# Altium project handMultilayer.PrjPcb
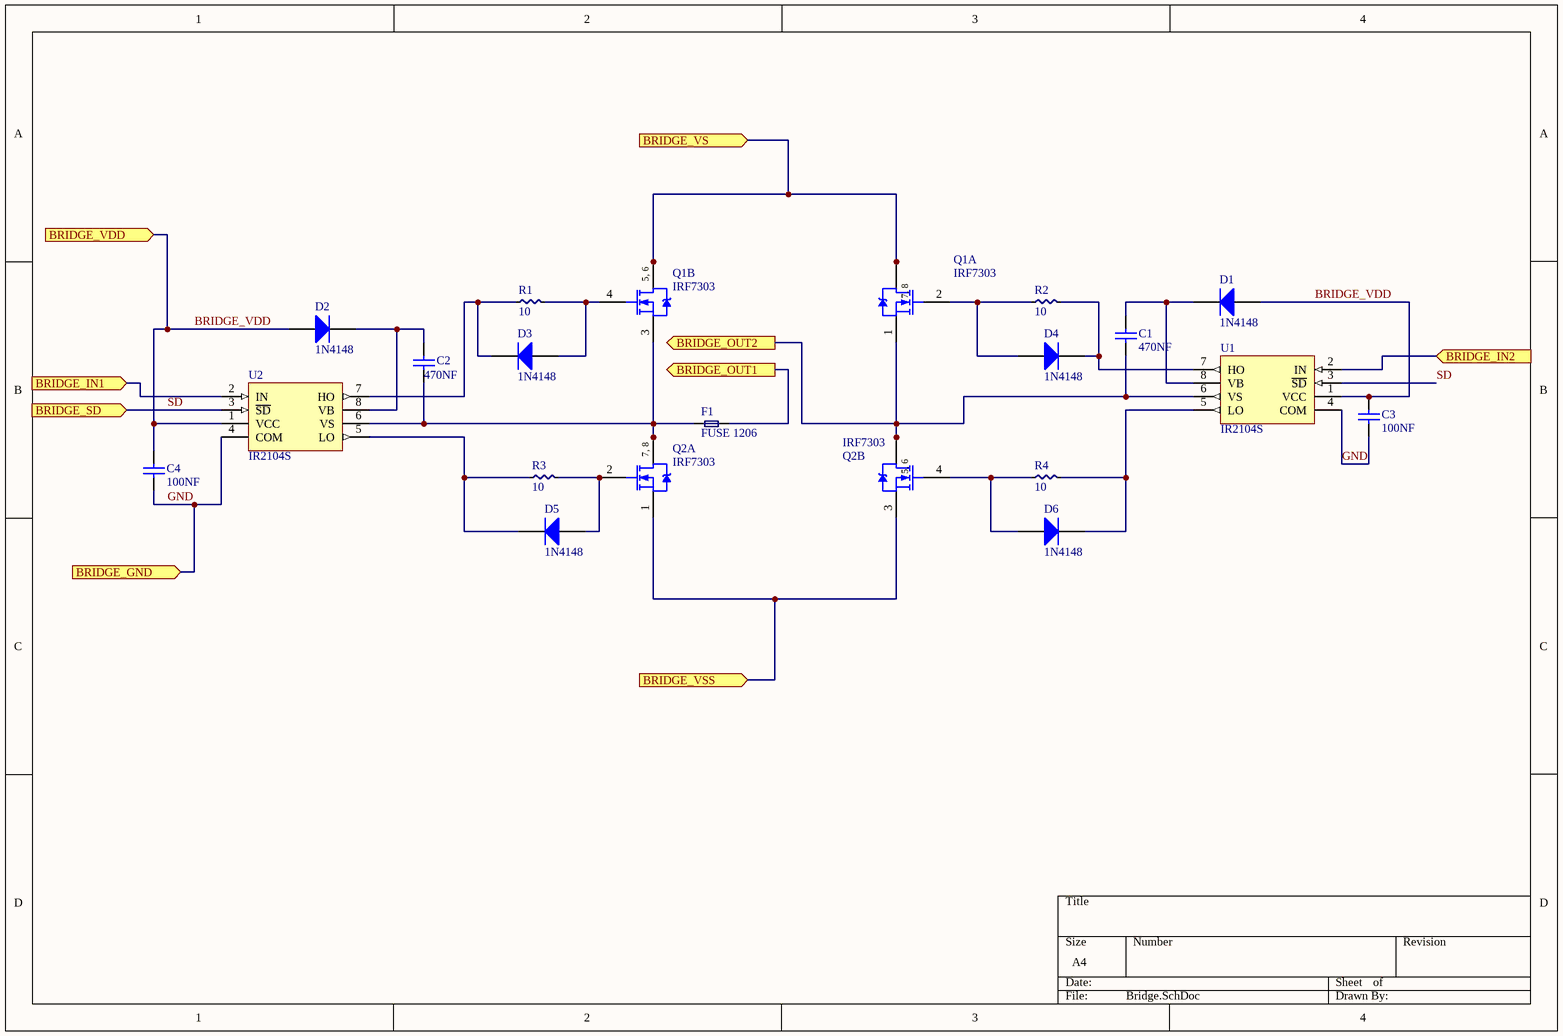
[diagram p0: Bridge.SchDoc]
3 sheets, 69 parts. Net scope: hierarchical (ports join the sheet entries above them; power ports are global).
Board file: HAND_MULTILAYER.PcbDoc
Sheets:
  Bridge.SchDoc
  main.SchDoc
  PULSE_SELECT.SchDoc

## Sheet Bridge.SchDoc
size A4

### Parts
C1  470NF  [MY_CAP_SMD_1206]
C2  470NF  [MY_CAP_SMD_1206]
C3  100NF  [MY_CAP_SMD_0805]
C4  100NF  [MY_CAP_SMD_0805]
D1  1N4148  [MY_DIOD1N5822_SMD]
D2  1N4148  [MY_DIOD1N5822_SMD]
D3  1N4148  [MY_DIOD1N5822_SMD]
D4  1N4148  [MY_DIOD1N5822_SMD]
D5  1N4148  [MY_DIOD1N5822_SMD]
D6  1N4148  [MY_DIOD1N5822_SMD]
F1  FUSE 1206  [FUSE1206]
Q1  IRF7303  [SO-8_N]  (parts A,B of 2)
Q2  IRF7303  [SO-8_N]  (parts A,B of 2)
R1  10  [MY_RES_SMD_0805]
R2  10  [MY_RES_SMD_0805]
R3  10  [MY_RES_SMD_0805]
R4  10  [MY_RES_SMD_0805]
U1  IR2104S  [SO-8_N]
U2  IR2104S  [SO-8_N]

### Ports
BRIDGE_GND (in), BRIDGE_IN1 (in), BRIDGE_IN2 (in), BRIDGE_OUT1 (out), BRIDGE_OUT2 (out), BRIDGE_SD (in), BRIDGE_VDD (in), BRIDGE_VS (in), BRIDGE_VSS (in)

### Nets
BRIDGE_VDD: C3.2 C4.2 D1.A D2.A U1.1(VCC) U2.1(VCC) ; port BRIDGE_VDD
GND: C3.1 C4.1 U1.4(COM) U2.4(COM) ; port BRIDGE_GND
SD: U1.3(~{SD}) U2.3(~{SD}) ; port BRIDGE_SD
NetC1_1: C1.1 Q1.1(S) Q2.5(D) Q2.6(D) U1.6(VS) ; port BRIDGE_OUT2
NetC1_2: C1.2 D1.K U1.8(VB)
NetC2_1: C2.1 F1.2 Q1.3(S) Q2.7(D) Q2.8(D) U2.6(VS)
NetC2_2: C2.2 D2.K U2.8(VB)
NetD3_A: D3.A Q1.4(G) R1.2
NetD3_K: D3.K R1.1 U2.7(HO)
NetD4_A: D4.A Q1.2(G) R2.1
NetD4_K: D4.K R2.2 U1.7(HO)
NetD5_A: D5.A Q2.2(G) R3.2
NetD5_K: D5.K R3.1 U2.5(LO)
NetD6_A: D6.A Q2.4(G) R4.1
NetD6_K: D6.K R4.2 U1.5(LO)
NetF1_1: F1.1 ; port BRIDGE_OUT1
NetQ1_5: Q1.5(D) Q1.6(D) Q1.7(D) Q1.8(D) ; port BRIDGE_VS
NetQ2_1: Q2.1(S) Q2.3(S) ; port BRIDGE_VSS
NetU1_2: U1.2(IN) ; port BRIDGE_IN2
NetU2_2: U2.2(IN) ; port BRIDGE_IN1

### Notes on the sheet
- (in symbol IRF7303, part A) 7, 8
- (in symbol IRF7303, part B) 5, 6

### Library data of the parts
C1 C2 = CAP SMD_1206: 3.2 mm × 1.6 mm
C3 C4 = CAP SMD_0805: 2.0 mm × 1.25 mm
D1-D6 = 1N5822-smd-5*2mm
Q1 Q2 = IRF7303: HEXFET Power MOSFET; Published: 8-Jun-2000; LatestRevisionDate: 13-Apr-2006; LatestRevisionNote: IPC-7351 Footprint Added.; DatasheetVersion: Aug-1997; PackageVersion: Feb-2001; PackageReference: SO-8; Publisher: Altium Limited; PackageDescription: 8-Pin Plastic Small Outline Integrated Circuit 1.27 mm Pitch; Code_JEDEC: MS-012-AA; Code_IPC: SOIC127P600-8; ComponentLink1Description: Manufacturer Link; ComponentLink1URL: http://www.irf.com/; ComponentLink2Description: Datasheet; ComponentLink2URL: http://www.irf.com/product-info/datasheets/data/irf7303.pdf
R1-R4 = RES SMD 0805
U1 U2 = IR2104S: High and Low Side Driver; Published: 8-Jun-2000; LatestRevisionDate: 13-Apr-2006; LatestRevisionNote: IPC-7351 Footprint Added.; DatasheetVersion: PD600461; PackageVersion: Feb-2001; PackageReference: SO-8; Publisher: Altium Limited; PackageDescription: 8-Pin Plastic Small Outline Integrated Circuit 1.27 mm Pitch; Code_JEDEC: MS-012-AA; Code_IPC: SOIC127P600-8; ComponentLink1Description: Manufacturer Link; ComponentLink1URL: http://www.irf.com/; ComponentLink2Description: Datasheet; ComponentLink2URL: http://www.irf.com/product-info/datasheets/data/ir2104.pdf

## Sheet main.SchDoc
size A2
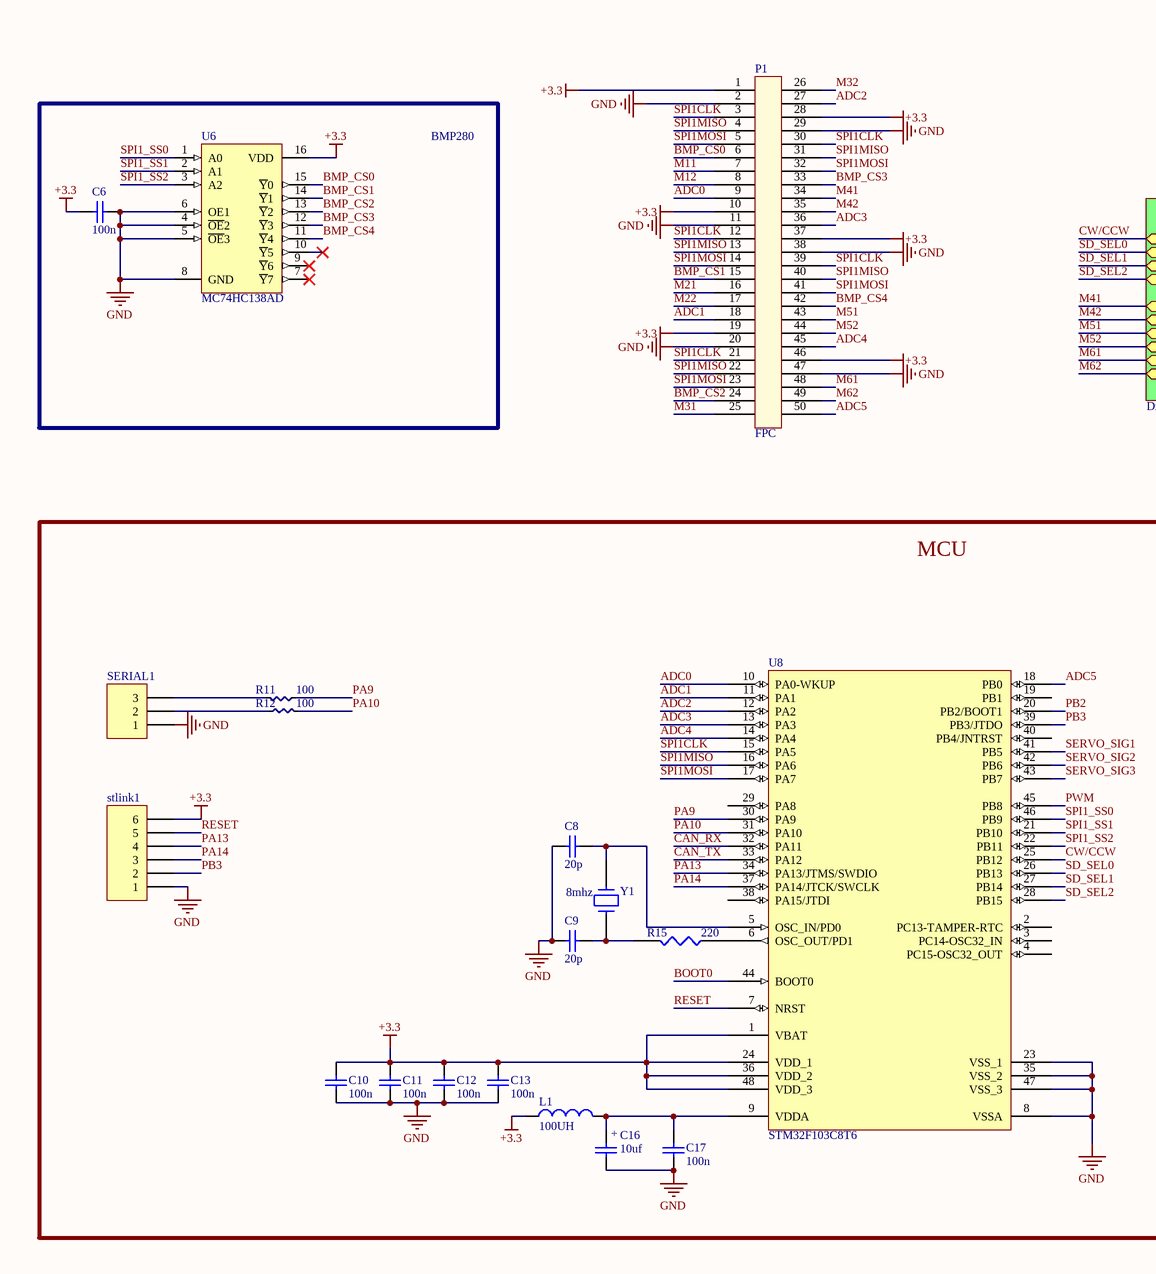
[diagram p1: main.SchDoc, left]
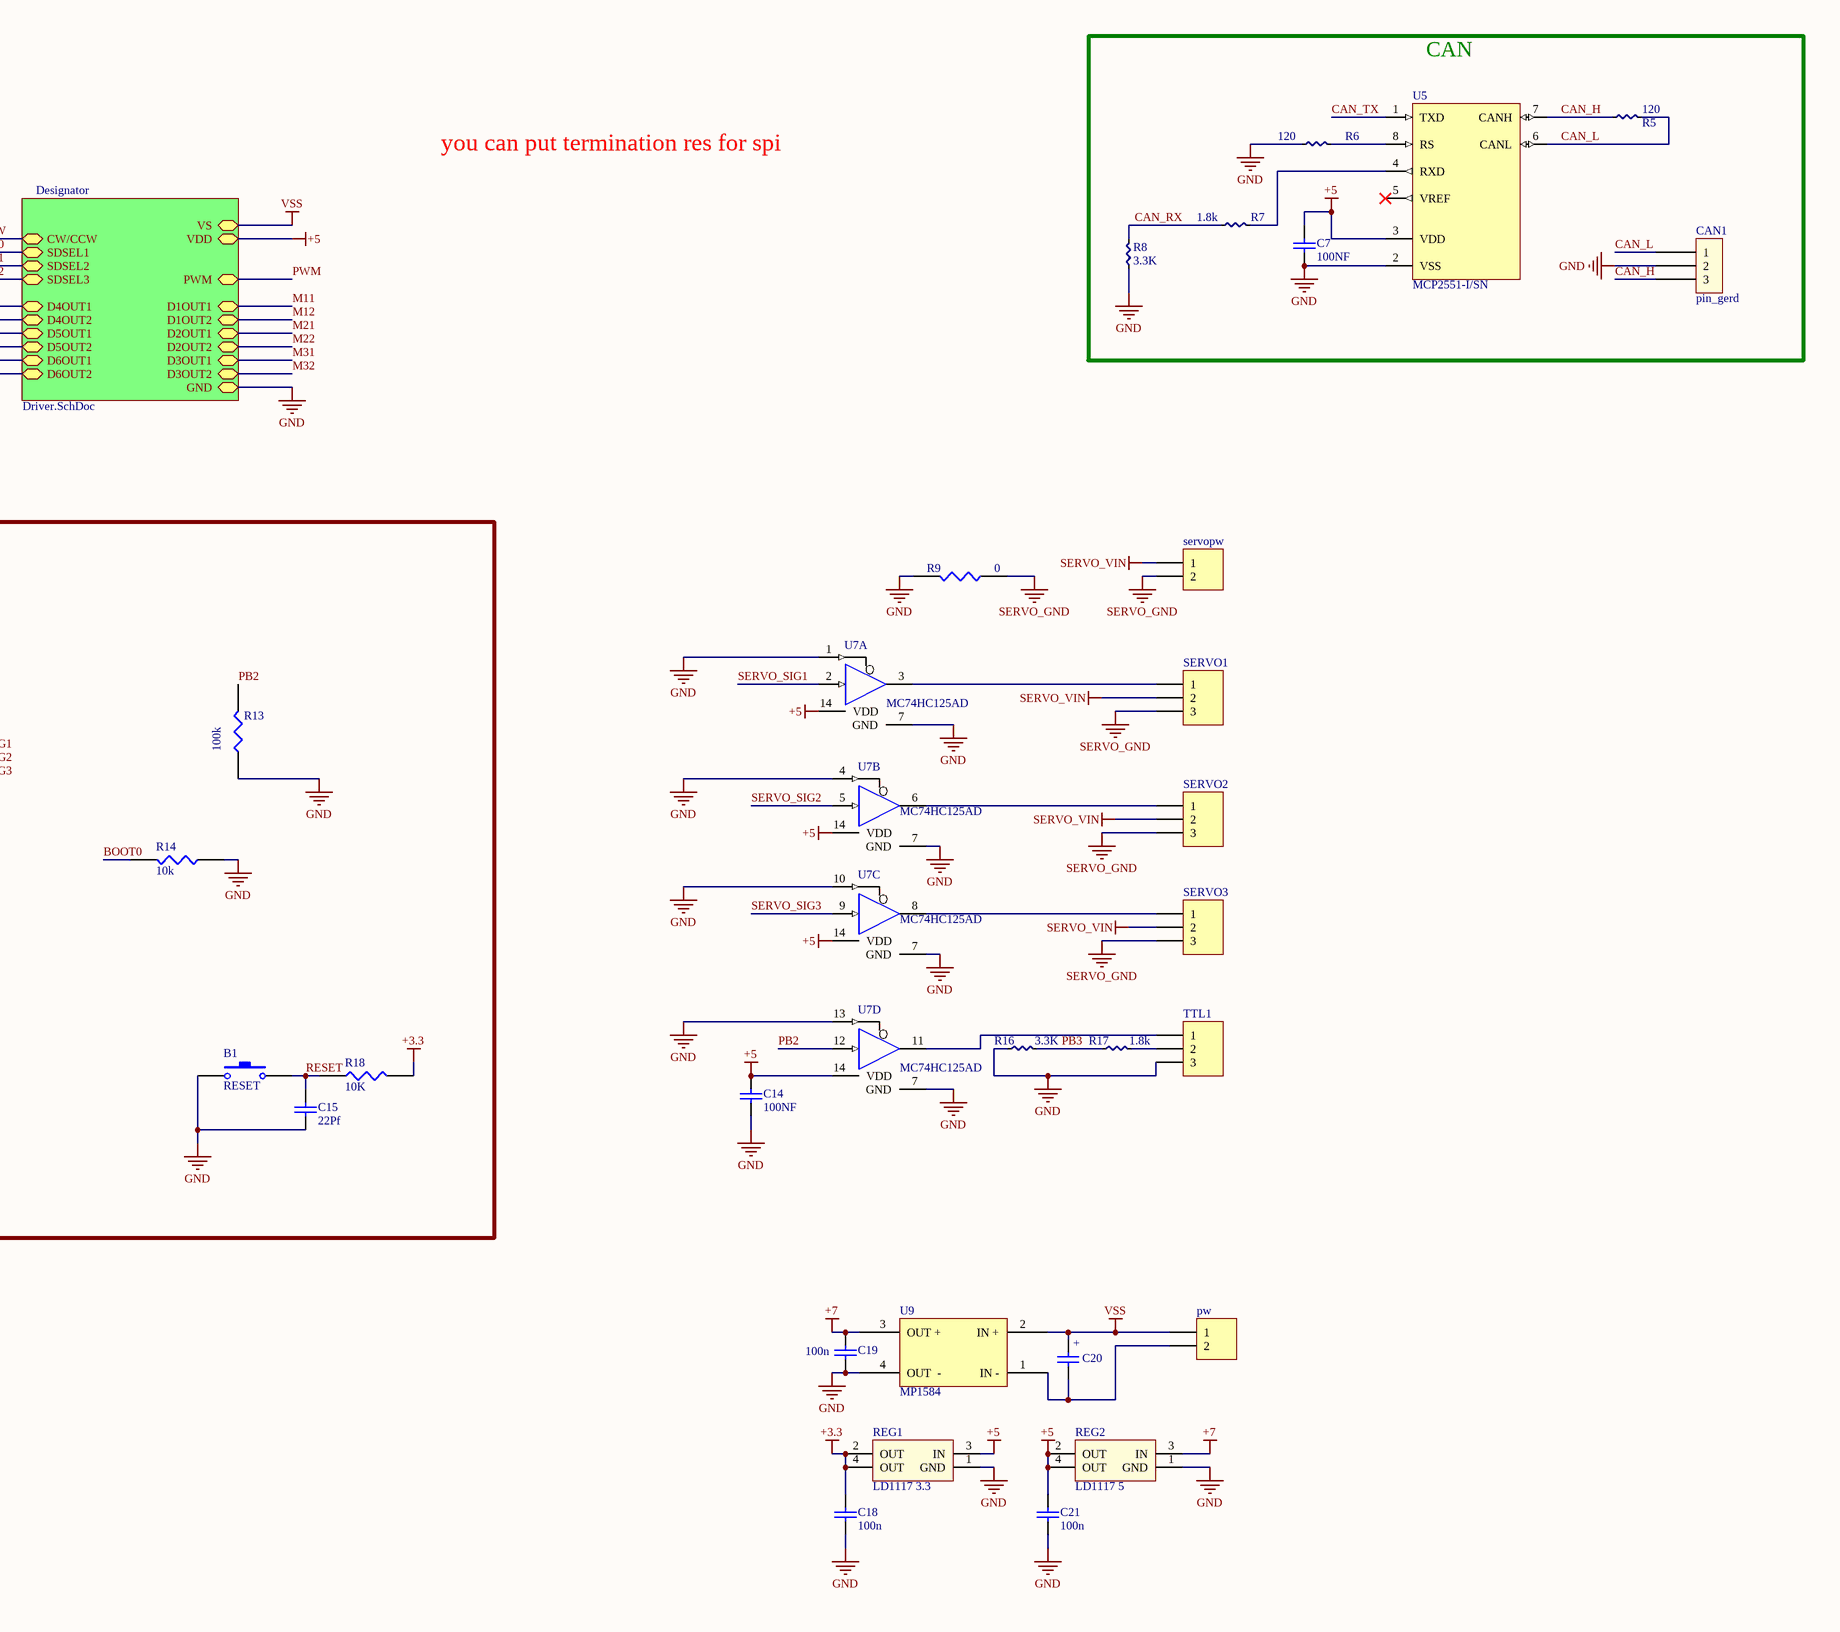
[diagram p2: main.SchDoc, right]

### Parts
B1  RESET  [SMD PUSH BUTTON]
C6  100n  [MY_CAP_SMD_0805]
C7  100NF  [MY_CAP_SMD_0805]
C8  20p  [MY_CAP_SMD_0805]
C9  20p  [MY_CAP_SMD_0805]
C10  100n  [MY_CAP_SMD_0805]
C11  100n  [MY_CAP_SMD_0805]
C12  100n  [MY_CAP_SMD_0805]
C13  100n  [MY_CAP_SMD_0805]
C14  100NF  [MY_CAP_SMD_0805]
C15  22Pf  [MY_CAP_SMD_0805]
C16  10uf  [MY_cap_smd10uf]
C17  100n  [MY_CAP_SMD_0805]
C18  100n  [MY_CAP_SMD_0805]
C19  100n  [MY_CAP_SMD_0805]
C20  Cap  [MY_CAP_SMD-C]  (value not drawn)
C21  100n  [MY_CAP_SMD_0805]
CAN1  pin_gerd  [MY_PINGERD3]
L1  100UH  [MY_SMD_INDUCTOR]
P1  FPC  [FPC-50-POS-0.5-MM]
pw  Header 2  [My_1X02]  (value not drawn)
R5  120  [MY_RES_SMD_0805]
R6  120  [MY_RES_SMD_0805]
R7  1.8k  [MY_RES_SMD_0805]
R8  3.3K  [MY_RES_SMD_0805]
R9  0  [MY_RES_SMD_0805]
R11  100  [MY_RES_SMD_0805]
R12  100  [MY_RES_SMD_0805]
R13  100k  [MY_RES_SMD_0805]
R14  10k  [MY_RES_SMD_0805]
R15  220  [MY_RES_SMD_0805]
R16  3.3K  [MY_RES_SMD_0805]
R17  1.8k  [MY_RES_SMD_0805]
R18  10K  [MY_RES_SMD_0805]
REG1  LD1117 3.3  [MY_LD1117-3.3]
REG2  LD1117 5  [MY_LD1117-3.3]
SERIAL1  Header 3  [My_1X03]  (value not drawn)
SERVO1  Header 3  [My_1X03]  (value not drawn)
SERVO2  Header 3  [My_1X03]  (value not drawn)
SERVO3  Header 3  [My_1X03]  (value not drawn)
servopw  Header 2  [My_1X02]  (value not drawn)
stlink1  Header 6  [My_1X06]  (value not drawn)
TTL1  Header 3  [My_1X03]  (value not drawn)
U5  MCP2551-I/SN  [SOIC-SN8_N]
U6  MC74HC138AD  [751B-03_N]
U7  MC74HC125AD  [751A-02_N]  (parts A,B,C,D of 4)
U8  STM32F103C8T6  [LQFP48_N]
U9  MP1584  [mp1584]
Y1  8mhz  [My_Crystal - SMD]

### Blocks framed on the sheet
CAN: C7 CAN1 R5-R8 U5
BMP280: C6 U6
MCU: B1 C8-C13 C15-C17 L1 R11-R15 R18 SERIAL1 stlink1 U8 Y1

### Sub-sheets
Designator = Driver.SchDoc (file not in this document): CW/CCW, GND, PWM, D1OUT1, D1OUT2, VDD, VS, SDSEL1, SDSEL2, SDSEL3, D2OUT1, D2OUT2, D3OUT1, D3OUT2, D4OUT1, D4OUT2, D5OUT1, D5OUT2, D6OUT1, D6OUT2

### Nets
+3.3: C6.2 C10.2 C11.2 C12.2 C13.2 C18.2 L1.1 P1.1 P1.10 P1.19 P1.28 P1.37 P1.46 R18.2 REG1.2(OUT) REG1.4(OUT) stlink1.6 U6.16(VDD) U8.1(VBAT) U8.24(VDD_1) U8.36(VDD_2) U8.48(VDD_3)
+5: C7.2 C14.2 C21.2 REG1.3(IN) REG2.2(OUT) REG2.4(OUT) U5.3(VDD) U7.14(VDD) ; sheet Designator/VDD
+7: C19.2 REG2.3(IN) U9.3(OUT_+)
GND: B1.1 C6.1 C7.1 C8.2 C9.1 C10.1 C11.1 C12.1 C13.1 C14.1 C15.1 C16.- C17.1 C18.1 C19.1 C21.1 CAN1.2 P1.2 P1.11 P1.20 P1.29 P1.38 P1.47 R6.1 R8.1 R9.2 R13.1 R14.1 R16.1 REG1.1(GND) REG2.1(GND) SERIAL1.1 stlink1.1 TTL1.3 U5.2(VSS) U6.4(~{OE}2) U6.5(~{OE}3) U6.6(OE1) U6.8(GND) U7.1(~{OE}) U7.4(~{OE}) U7.7(GND) U7.10(~{OE}) U7.13(~{OE}) U8.8(VSSA) U8.23(VSS_1) U8.35(VSS_2) U8.47(VSS_3) U9.4(OUT__-) ; sheet Designator/GND
SERVO_GND: R9.1 SERVO1.3 SERVO2.3 SERVO3.3 servopw.2
SERVO_VIN: SERVO1.2 SERVO2.2 SERVO3.2 servopw.1
VSS: C20.+ pw.1 U9.2(IN_+) ; sheet Designator/VS
ADC0: P1.9 U8.10(PA0-WKUP)
ADC1: P1.18 U8.11(PA1)
ADC2: P1.27 U8.12(PA2)
ADC3: P1.36 U8.13(PA3)
ADC4: P1.45 U8.14(PA4)
ADC5: P1.50 U8.18(PB0)
BMP_CS0: P1.6 U6.15(~{Y}0)
BMP_CS1: P1.15 U6.14(~{Y}1)
BMP_CS2: P1.24 U6.13(~{Y}2)
BMP_CS3: P1.33 U6.12(~{Y}3)
BMP_CS4: P1.42 U6.11(~{Y}4)
BOOT0: R14.2 U8.44(BOOT0)
CAN_H: CAN1.3 R5.1 U5.7(CANH)
CAN_L: CAN1.1 R5.2 U5.6(CANL)
CAN_RX: R7.1 R8.2 U8.32(PA11)
CAN_TX: U5.1(TXD) U8.33(PA12)
CW/CCW: U8.25(PB12) ; sheet Designator/CW/CCW
M11: P1.7 ; sheet Designator/D1OUT1
M12: P1.8 ; sheet Designator/D1OUT2
M21: P1.16 ; sheet Designator/D2OUT1
M22: P1.17 ; sheet Designator/D2OUT2
M31: P1.25 ; sheet Designator/D3OUT1
M32: P1.26 ; sheet Designator/D3OUT2
M41: P1.34 ; sheet Designator/D4OUT1
M42: P1.35 ; sheet Designator/D4OUT2
M51: P1.43 ; sheet Designator/D5OUT1
M52: P1.44 ; sheet Designator/D5OUT2
M61: P1.48 ; sheet Designator/D6OUT1
M62: P1.49 ; sheet Designator/D6OUT2
PA9: R11.1 U8.30(PA9)
PA10: R12.2 U8.31(PA10)
PA13: stlink1.4 U8.34(PA13/JTMS/SWDIO)
PA14: stlink1.3 U8.37(PA14/JTCK/SWCLK)
PB2: R13.2 U7.12(A) U8.20(PB2/BOOT1)
PB3: R16.2 R17.1 stlink1.2 U8.39(PB3/JTDO)
PWM: U8.45(PB8) ; sheet Designator/PWM
RESET: B1.2 C15.2 R18.1 stlink1.5 U8.7(NRST)
SD_SEL0: U8.26(PB13) ; sheet Designator/SDSEL1
SD_SEL1: U8.27(PB14) ; sheet Designator/SDSEL2
SD_SEL2: U8.28(PB15) ; sheet Designator/SDSEL3
SERVO_SIG1: U7.2(A) U8.41(PB5)
SERVO_SIG2: U7.5(A) U8.42(PB6)
SERVO_SIG3: U7.9(A) U8.43(PB7)
SPI1_SS0: U6.1(A0) U8.46(PB9)
SPI1_SS1: U6.2(A1) U8.21(PB10)
SPI1_SS2: U6.3(A2) U8.22(PB11)
SPI1CLK: P1.3 P1.12 P1.21 P1.30 P1.39 U8.15(PA5)
SPI1MISO: P1.4 P1.13 P1.22 P1.31 P1.40 U8.16(PA6)
SPI1MOSI: P1.5 P1.14 P1.23 P1.32 P1.41 U8.17(PA7)
NetC8_1: C8.1 U8.5(OSC_IN/PD0) Y1.2
NetC9_2: C9.2 R15.2 Y1.1
NetC16_+: C16.+ C17.2 L1.2 U8.9(VDDA)
NetC20_-: C20.- pw.2 U9.1(IN_-)
NetR6_2: R6.2 U5.8(RS)
NetR7_2: R7.2 U5.4(RXD)
NetR11_2: R11.2 SERIAL1.3
NetR12_1: R12.1 SERIAL1.2
NetR15_1: R15.1 U8.6(OSC_OUT/PD1)
NetR17_2: R17.2 TTL1.2
NetSERVO1_1: SERVO1.1 U7.3(Y)
NetSERVO2_1: SERVO2.1 U7.6(Y)
NetSERVO3_1: SERVO3.1 U7.8(Y)
NetTTL1_1: TTL1.1 U7.11(Y)

Not connected (* = marked no-connect by the designer): U5 5(VREF)*; U6 7(~{Y}7)* 9(~{Y}6)* 10(~{Y}5)*; U8 2(PC13-TAMPER-RTC) 3(PC14-OSC32_IN) 4(PC15-OSC32_OUT) 19(PB1) 29(PA8) 38(PA15/JTDI) 40(PB4/JNTRST)

### Notes on the sheet
- you can put termination res for spi

### Library data of the parts
B1 = SMD_PUSH_BUTTON
C6 C8-C13 C15 C17-C19 C21 = CAP SMD
C7 C14 = CAP SMD_0805: 2.0 mm × 1.25 mm
C16 = cap_smd_10u
C20 = CAP_TANTAL_C: 6X3.2MM; Value: 3300u
CAN1 = pin_gerd: 3pin
L1 = INDUCTOR SMD
P1 = FPC-50-POS-0.5-MM
pw servopw = Header 2: Header, 2-Pin; LatestRevisionDate: 17-Jul-2002; LatestRevisionNote: Re-released for DXP Platform.; Publisher: Altium Limited
R5-R8 R11 R12 R16 R17 = RES SMD 0805
R9 R13-R15 R18 = RES SMD
REG2 = LD1117 3.3
SERIAL1 SERVO1-SERVO3 TTL1 = Header 3: Header, 3-Pin; LatestRevisionDate: 17-Jul-2002; LatestRevisionNote: Re-released for DXP Platform.; Publisher: Altium Limited
  SERVO1: LINK: https://www.digikey.ca/en/products/detail/molex/0099990987/2405394
stlink1 = Header 6: Header, 6-Pin; LatestRevisionDate: 17-Jul-2002; LatestRevisionNote: Re-released for DXP Platform.; Publisher: Altium Limited
U5 = MCP2551-I/SN: High-Speed CAN Transceiver, 8-Pin SOIC, Industrial Temperature; Published: 29-Jan-2009; DatasheetVersion: revE, Jan-2007; PackageVersion: revAW, Oct-2008; PackageReference: SOIC-SN8; Publisher: Altium Limited; PackageDescription: 8-Lead Plastic Small Outline (SN) - Narrow, 3.90mm Body [SOIC]; Code_JEDEC: MS-012; Code_IPC: SOIC127P600-8; ComponentLink1Description: Manufacturer Link; ComponentLink1URL: http://www.microchip.com; ComponentLink2Description: Datasheet; ComponentLink2URL: http://ww1.microchip.com/downloads/en/DeviceDoc/21667E.pdf; ComponentLink3Description: Packaging Specification; ComponentLink3URL: http://ww1.microchip.com/downloads/en/PackagingSpec/00049AW.pdf
U6 = MC74HC138AD: 1-of-8 Decoder/Demultiplexer; Published: 17-Jul-2002; LatestRevisionDate: 13-Apr-2006; LatestRevisionNote: IPC-7351 Footprint Added.; DatasheetVersion: 1989; PackageVersion: 1991; PackageReference: 751B-03; Publisher: Altium Limited; PackageDescription: 16-Pin Small Outline Integrated Circuit 1.27 mm Pitch; Code_JEDEC: MS-012-AC; Code_IPC: SOIC127P600-16; ComponentLink1Description: Manufacturer Link; ComponentLink1URL: http://www.onsemi.com/site/products/parametrics/0,4446,419,00.html; ComponentLink2Description: Datasheet; ComponentLink2URL: http://www.onsemi.com/pub/Collateral/MC74HC138A-D.PDF
U7 = MC74HC125AD: Quad 3-State Non-Inverting Buffer; Published: 17-Jul-2002; LatestRevisionDate: 13-Apr-2006; LatestRevisionNote: IPC-7351 Footprint Added.; DatasheetVersion: 1989; PackageVersion: 1991; PackageReference: 751A-02; Publisher: Altium Limited; PackageDescription: 14-Pin Small Outline Integrated Circuit 1.27 mm Pitch; Code_IPC: SOIC127P600-14; ComponentLink1Description: Manufacturer Link; ComponentLink1URL: http://www.onsemi.com/site/products/parametrics/0,4446,178,00.html
U8 = STM32F103C8T6: STM32 ARM-based 32-bit MCU with 64 Kbytes Flash, 48-pin LQFP, Industrial Temperature; Published: 30-May-2008; DatasheetVersion: rev6, Mar-2008; PackageVersion: Mar-2008; PackageReference: LQFP48; Publisher: Altium Limited; PackageDescription: 48-Pin Low-Profile Quad Flat Pack, 7 x 7 mm Body, 0.5 mm Pitch (LQFP48); ComponentLink1Description: Manufacturer Link; ComponentLink1URL: www.st.com/stm32; ComponentLink2Description: Datasheet; ComponentLink2URL: http://www.st.com/stonline/products/literature/ds/13587.pdf; Link: https://www.digikey.ca/en/products/detail/stmicroelectronics/stm32f103c8t6/1646338
U9 = MP1584: SWITCHING REGULATOR MODULE; PART: MP1584EN-LF-Z; LINK: https://www.digikey.ca/en/products/detail/monolithic-power-systems-inc/MP1584EN-LF-Z/5291742; PACKAGE: 8-SOIC (0.154", 3.90mm Width) Exposed Pad
Y1 = CRYSTAL

## Sheet PULSE_SELECT.SchDoc
size A
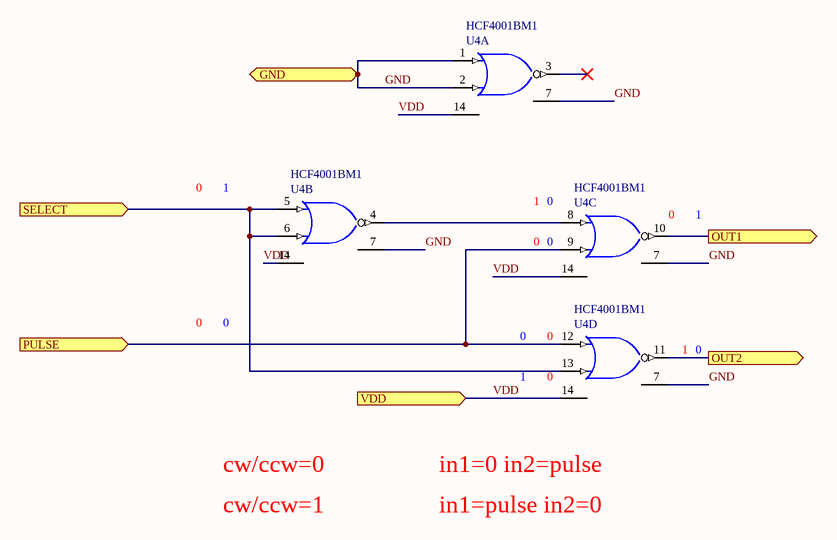
[diagram p3: PULSE_SELECT.SchDoc]

### Parts
U4  HCF4001BM1  [SO14_N]  (parts A,B,C,D of 4)

### Ports
GND (in), OUT1 (out), OUT2 (out), PULSE (in), SELECT (in), VDD (in)

### Nets
GND: U4.1(A) U4.2(B) U4.7(GND) ; port GND
VDD: U4.14(VDD) ; port VDD
NetU4_4: U4.4(K) U4.8(E)
NetU4_5: U4.5(C) U4.6(D) U4.13(H) ; port SELECT
NetU4_9: U4.9(F) U4.12(G) ; port PULSE
NetU4_10: U4.10(L) ; port OUT1
NetU4_11: U4.11(M) ; port OUT2

Not connected (* = marked no-connect by the designer): U4 3(J)*

### Notes on the sheet
- 0
- 1
- (near U4) 1
- (near U4) 0
- cw/ccw=0
- in1=0 in2=pulse
- cw/ccw=1
- in1=pulse in2=0

### Library data of the parts
U4 = HCF4001BM1: Quad 2-Input NOR Gate; Published: 8-Jun-2000; LatestRevisionDate: 13-Apr-2006; LatestRevisionNote: IPC-7351 Footprint Added.; DatasheetVersion: Sep-1988; PackageVersion: Sep-1998; PackageReference: SO14; Publisher: Altium Limited; PackageDescription: 14-Pin Small Outline Integrated Circuit 1.27 mm Pitch; Code_IPC: SOIC127P600-14; ComponentLink1Description: Manufacturer Link; ComponentLink1URL: http://www.st.com/; ComponentLink2Description: Datasheet; ComponentLink2URL: http://www.st.com/stonline/products/literature/ds/8098/hcf4001.pdf